# Altium project PCB_Project.PrjPcb
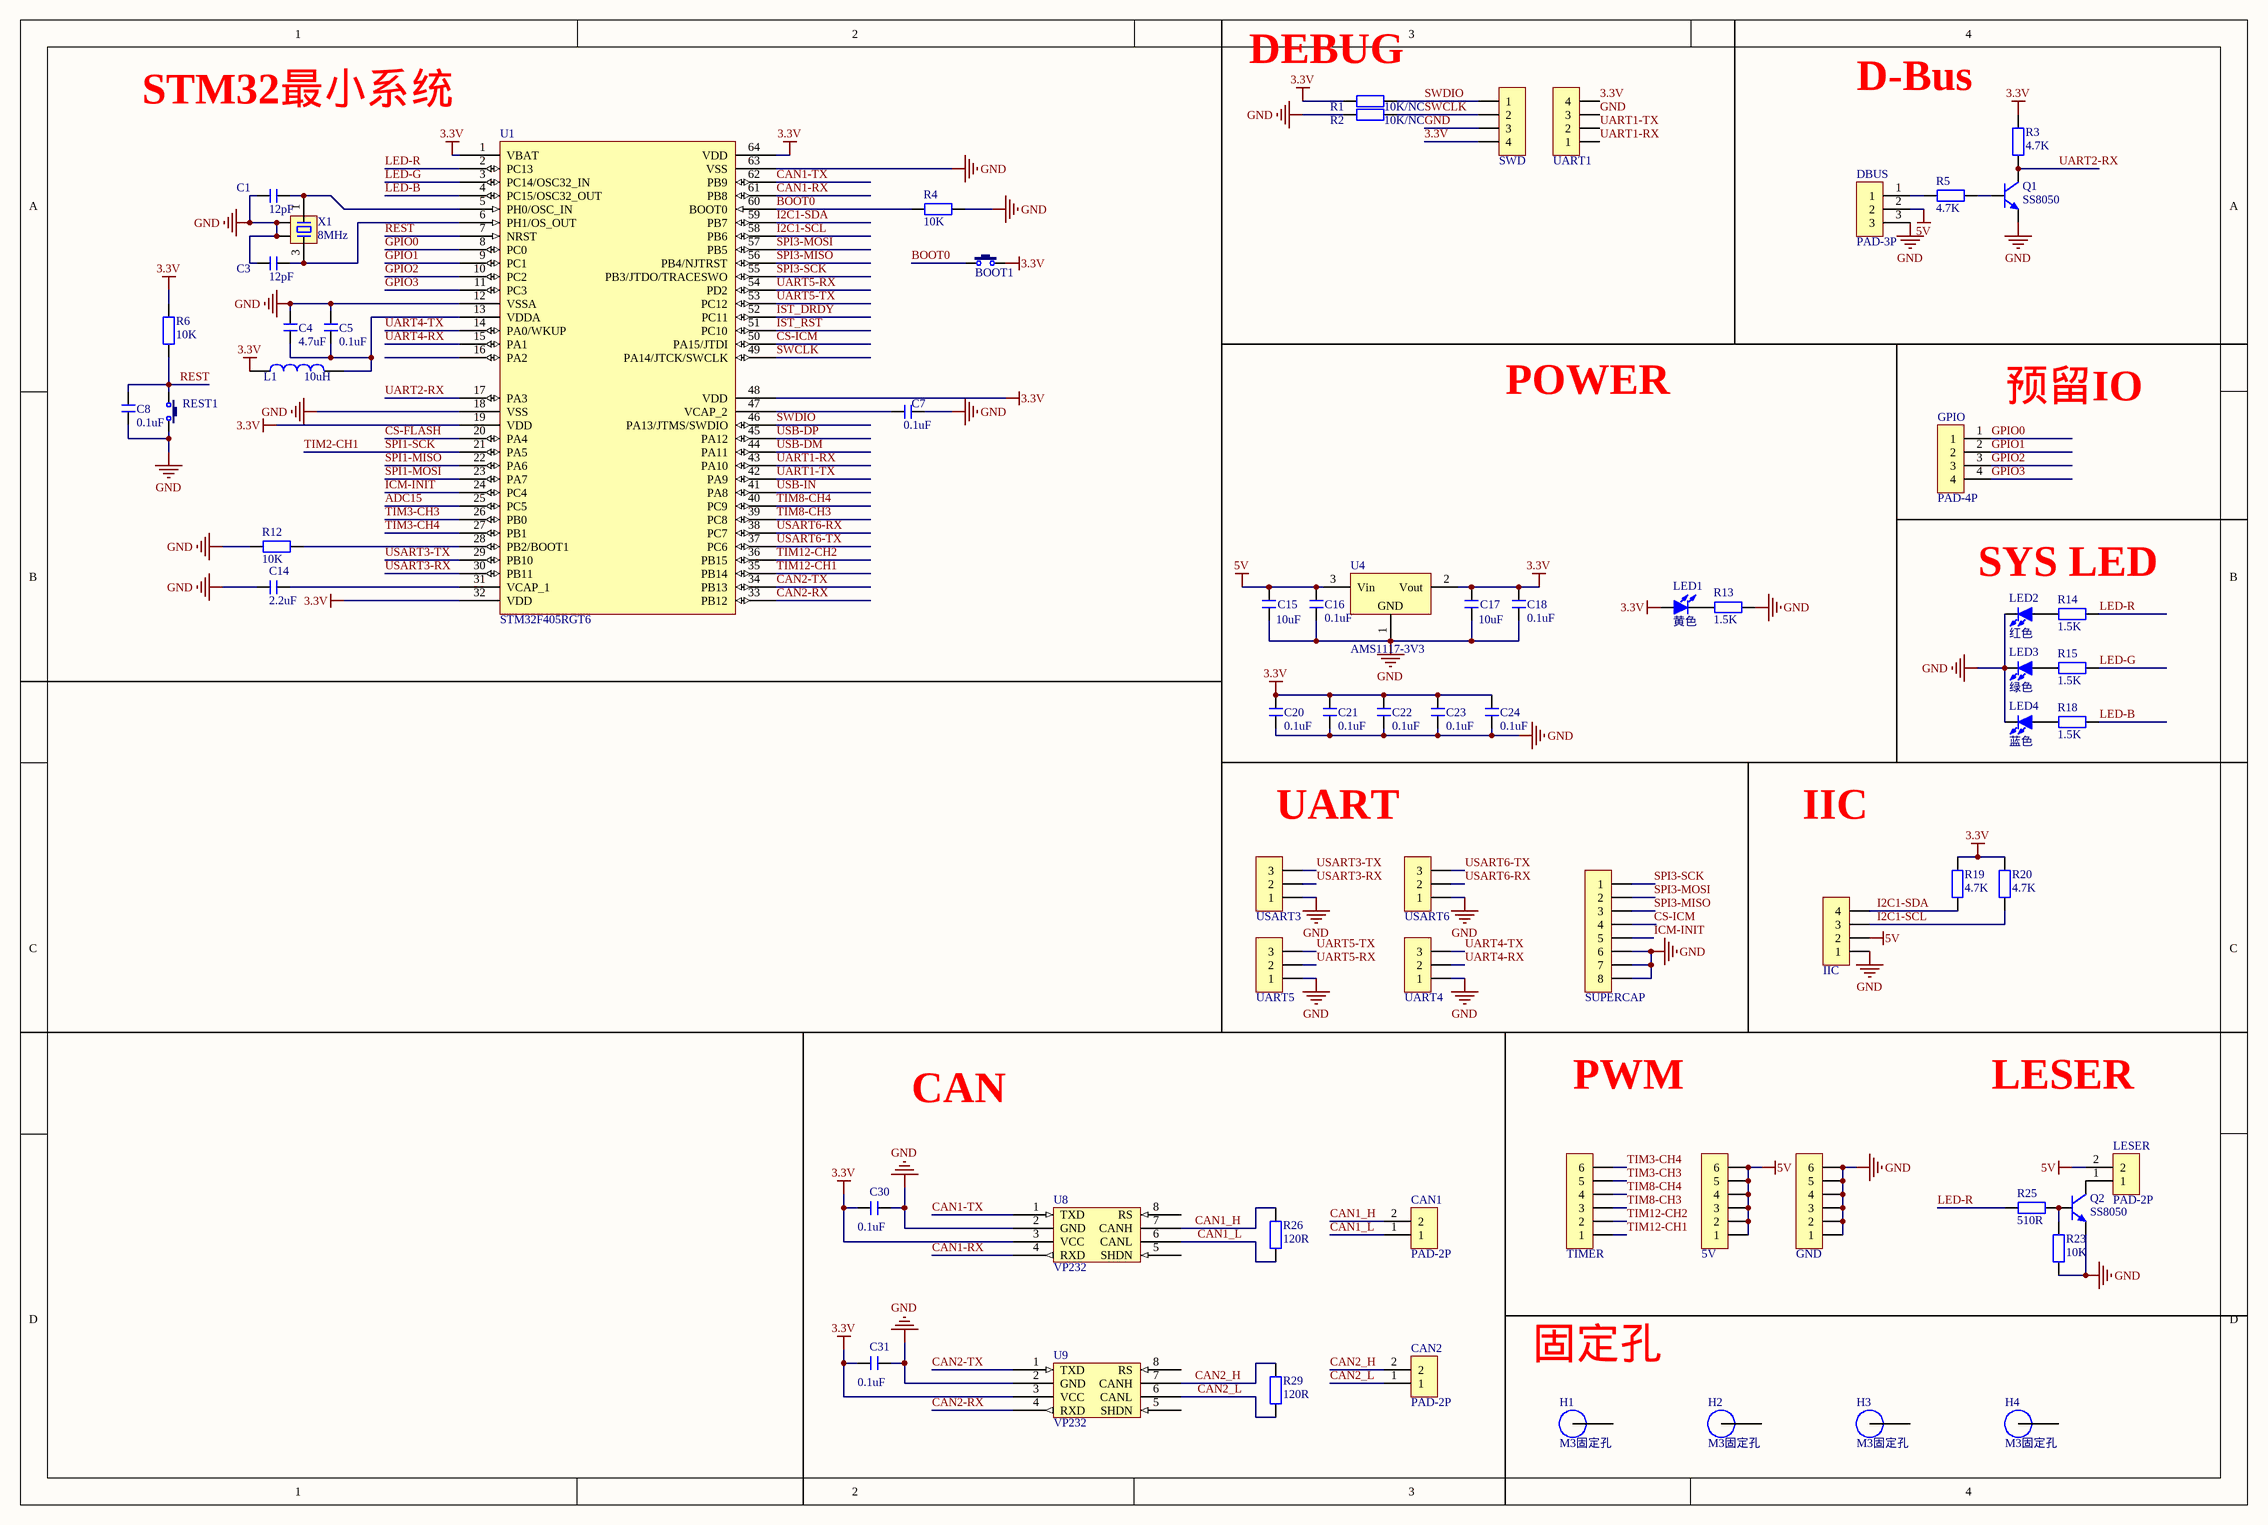
[diagram p0: F4AIR.SchDoc]
1 sheet, 69 parts. Net scope: global (net labels, ports and power ports of the same name join across sheets).
Board file: F4AIR.PcbDoc

## Sheet F4AIR.SchDoc
size 419 x 279 mm

### Parts
5V  HDR-1X6  [HDR2.54-LI-6P]  (value not drawn)
BOOT1  3x6x5  [TSW SMD-3*6*5]  (value not drawn)
C1  12pF  [C 0603_M]
C3  12pF  [C 0603_M]
C4  4.7uF  [C 0603_M]
C5  0.1uF  [C 0603_M]
C7  0.1uF  [C 0603_M]
C8  0.1uF  [C 0603_M]
C14  2.2uF  [C 0603_M]
C15  10uF  [C 0805_M]
C16  0.1uF  [C 0603_M]
C17  10uF  [C 0805_M]
C18  0.1uF  [C 0603_M]
C20  0.1uF  [C 0603_M]
C21  0.1uF  [C 0603_M]
C22  0.1uF  [C 0603_M]
C23  0.1uF  [C 0603_M]
C24  0.1uF  [C 0603_M]
C30  0.1uF  [C 0603_M]
C31  0.1uF  [C 0603_M]
CAN1  PAD-2P  [MX 1.25-WS-2P]
CAN2  PAD-2P  [MX 1.25-WS-2P]
DBUS  PAD-3P  [HDR2.54-WI-3P]
GND  HDR-1X6  [HDR2.54-LI-6P]  (value not drawn)
GPIO  PAD-4P  [PAD-1.25-4P]
H1  M3固定孔  [M3x4_N]
H2  M3固定孔  [M3x4_N]
H3  M3固定孔  [M3x4_N]
H4  M3固定孔  [M3x4_N]
IIC  HDR-1X4  [HDR2.54-LI-4P]  (value not drawn)
L1  10uH  [L 0603]
LED1  黄色  [LED 0603Y]
LED2  红色  [LED 0603R]
LED3  绿色  [LED 0603G]
LED4  蓝色  [LED 0603B]
LESER  PAD-2P  [MX 1.25-WS-2P]
Q1  SS8050  [SOT23-3M]
Q2  SS8050  [SOT23-3M]
R1  10K/NC  [R 0603_M]
R2  10K/NC  [R 0603_M]
R3  4.7K  [R 0603_M]
R4  10K  [R 0603_M]
R5  4.7K  [R 0603_M]
R6  10K  [R 0603_M]
R12  10K  [R 0603_M]
R13  1.5K  [R 0603_M]
R14  1.5K  [R 0603_M]
R15  1.5K  [R 0603_M]
R18  1.5K  [R 0603_M]
R19  4.7K  [R 0603_M]
R20  4.7K  [R 0603_M]
R23  10K  [R 0603_M]
R25  510R  [R 0603_M]
R26  120R  [R 0603_M]
R29  120R  [R 0603_M]
REST1  3x6x5  [TSW SMD-3*6*5]  (value not drawn)
SUPERCAP  HDR-1X8  [MX 1.25-WS-6P]  (value not drawn)
SWD  HDR-1X4  [MX 1.25-WS-4P]  (value not drawn)
TIMER  HDR-1X6  [HDR2.54-LI-6P]  (value not drawn)
U1  STM32F405RGT6  [LQFP64]
U4  AMS1117-3V3  [SOT-89]
U8  VP232  [SOP8_M]
U9  VP232  [SOP8_M]
UART1  HDR-1X4  [MX 1.25-WS-4P]  (value not drawn)
UART4  HDR-1X3  [MX 1.25-WS-3P]  (value not drawn)
UART5  HDR-1X3  [MX 1.25-WS-3P]  (value not drawn)
USART3  HDR-1X3  [MX 1.25-WS-3P]  (value not drawn)
USART6  HDR-1X3  [MX 1.25-WS-3P]  (value not drawn)
X1  8MHz  [OSC 3225-4P]

### Nets
3.3V: BOOT1.2 C17.2 C18.1 C20.1 C21.1 C22.1 C23.1 C24.1 C30.2 C31.2 L1.1 LED1.1(A) R1.1 R3.2 R6.2 R19.1 R20.2 SWD.4 U1.1(VBAT) U1.19(VDD) U1.32(VDD) U1.48(VDD) U1.64(VDD) U4.2(Vout) U8.3(VCC) U9.3(VCC) UART1.4
5V: 5V.1 5V.2 5V.3 5V.4 5V.5 5V.6 C15.2 C16.1 DBUS.2 IIC.2 LESER.2 U4.3(Vin)
GND: C1.1 C3.1 C4.2 C5.2 C7.2 C8.1 C14.1 C15.1 C16.2 C17.1 C18.2 C20.2 C21.2 C22.2 C23.2 C24.2 C30.1 C31.1 DBUS.3 GND.1 GND.2 GND.3 GND.4 GND.5 GND.6 IIC.1 LED2.2(K) LED3.2(K) LED4.2(K) Q1.2(E) Q2.2(E) R2.1 R4.2 R12.1 R13.2 R23.1 REST1.2 SUPERCAP.6 SUPERCAP.7 SUPERCAP.8 SWD.3 U1.12(VSSA) U1.18(VSS) U1.63(VSS) U4.1(GND) U8.2(GND) U9.2(GND) UART1.3 UART4.1 UART5.1 USART3.1 USART6.1 X1.2 X1.4
ADC15: U1.25(PC5)
BOOT0: BOOT1.1 R4.1 U1.60(BOOT0)
CAN1-RX: U1.61(PB8) U8.4(RXD)
CAN1-TX: U1.62(PB9) U8.1(TXD)
CAN1_H: CAN1.2 R26.2 U8.7(CANH)
CAN1_L: CAN1.1 R26.1 U8.6(CANL)
CAN2-RX: U1.33(PB12) U9.4(RXD)
CAN2-TX: U1.34(PB13) U9.1(TXD)
CAN2_H: CAN2.2 R29.2 U9.7(CANH)
CAN2_L: CAN2.1 R29.1 U9.6(CANL)
CS-FLASH: U1.20(PA4)
CS-ICM: SUPERCAP.4 U1.50(PA15/JTDI)
GPIO0: GPIO.1 U1.8(PC0)
GPIO1: GPIO.2 U1.9(PC1)
GPIO2: GPIO.3 U1.10(PC2)
GPIO3: GPIO.4 U1.11(PC3)
I2C1-SCL: IIC.3 R20.1 U1.58(PB6)
I2C1-SDA: IIC.4 R19.2 U1.59(PB7)
ICM-INIT: SUPERCAP.5 U1.24(PC4)
IST_DRDY: U1.52(PC11)
IST_RST: U1.51(PC10)
LED-B: R18.2 U1.4(PC15/OSC32_OUT)
LED-G: R15.2 U1.3(PC14/OSC32_IN)
LED-R: R14.2 R25.1 U1.2(PC13)
REST: C8.2 R6.1 REST1.1 U1.7(NRST)
SPI1-MISO: U1.22(PA6)
SPI1-MOSI: U1.23(PA7)
SPI1-SCK: U1.21(PA5)  [also labelled TIM2-CH1]
SPI3-MISO: SUPERCAP.3 U1.56(PB4/NJTRST)
SPI3-MOSI: SUPERCAP.2 U1.57(PB5)
SPI3-SCK: SUPERCAP.1 U1.55(PB3/JTDO/TRACESWO)
SWCLK: R2.2 SWD.2 U1.49(PA14/JTCK/SWCLK)
SWDIO: R1.2 SWD.1 U1.46(PA13/JTMS/SWDIO)
TIM3-CH3: TIMER.5 U1.26(PB0)
TIM3-CH4: TIMER.6 U1.27(PB1)
TIM8-CH3: TIMER.3 U1.39(PC8)
TIM8-CH4: TIMER.4 U1.40(PC9)
TIM12-CH1: TIMER.1 U1.35(PB14)
TIM12-CH2: TIMER.2 U1.36(PB15)
UART1-RX: U1.43(PA10) UART1.1
UART1-TX: U1.42(PA9) UART1.2
UART2-RX: Q1.3(C) R3.1 U1.17(PA3)
UART4-RX: U1.15(PA1) UART4.2
UART4-TX: U1.14(PA0/WKUP) UART4.3
UART5-RX: U1.54(PD2) UART5.2
UART5-TX: U1.53(PC12) UART5.3
USART3-RX: U1.30(PB11) USART3.2
USART3-TX: U1.29(PB10) USART3.3
USART6-RX: U1.38(PC7) USART6.2
USART6-TX: U1.37(PC6) USART6.3
USB-DM: U1.44(PA11)
USB-DP: U1.45(PA12)
USB-IN: U1.41(PA8)
NetC1_2: C1.2 U1.5(PH0/OSC_IN) X1.1
NetC3_2: C3.2 U1.6(PH1/OS_OUT) X1.3
NetC4_1: C4.1 C5.1 L1.2 U1.13(VDDA)
NetC7_1: C7.1 U1.47(VCAP_2)
NetC14_2: C14.2 U1.31(VCAP_1)
NetDBUS_1: DBUS.1 R5.1
NetLED1_2: LED1.2(K) R13.1
NetLED2_1: LED2.1(A) R14.1
NetLED3_1: LED3.1(A) R15.1
NetLED4_1: LED4.1(A) R18.1
NetLESER_1: LESER.1 Q2.3(C)
NetQ1_1: Q1.1(B) R5.2
NetQ2_1: Q2.1(B) R23.2 R25.2
NetR12_2: R12.2 U1.28(PB2/BOOT1)

Not connected (* = marked no-connect by the designer): H1 1; H2 1; H3 1; H4 1; U1 16(PA2); U8 5(SHDN) 8(RS); U9 5(SHDN) 8(RS)

### Notes on the sheet
- STM32最小系统
- DEBUG
- D-Bus
- POWER
- (near GPIO) 预留IO
- SYS LED
- (near USART3) UART
- IIC
- CAN
- PWM
- LESER
- 固定孔
- Title
- Size:
- Date:
- A3
- Number:
- Time:
- Revision:
- Sheet
- of
- File:

### Library data of the parts
5V GND TIMER = Header 6: 6P接插件; 版权归属: 源创客; BOM名称: 6P接插件; 学习资源: www.ooocke.com
BOOT1 REST1 = TSW 3x6: 3x6轻触开关; 版权归属: 源创客; BOM名称: 3x6轻触开关; 学习资源: www.ooocke.com
C1 C3-C5 C7 C8 C14-C18 C20-C24 C30 C31 = C: 无极性贴片电容; 版权归属: 源创客; BOM名称: 无极性贴片电容; 学习资源: www.ooocke.com
H1-H4 = M3: 铜柱孔; 版权归属: 源创客; BOM名称: 铜柱孔; 学习资源: www.ooocke.com
IIC UART1 = HDR 2.54 -4P_1: HDR 2.54 -4P
L1 = L: 小功率贴片电感; 版权归属: 源创客; BOM名称: 小功率贴片电感; 学习资源: www.ooocke.com
LED1-LED4 = LED-SMD: 贴片LED; 版权归属: 源创客; BOM名称: 贴片LED; 学习资源: www.ooocke.com
Q1 Q2 = 8050-SMD: 高频放大-NPN型
R1-R6 R12-R15 R18-R20 R23 R25 R26 R29 = R: 贴片电阻; 版权归属: 源创客; BOM名称: 贴片电阻; 学习资源: www.ooocke.com
SUPERCAP = HDR 2.54 -8P
SWD = MX 1.25 -4P
U4 = AMS1117: 三端稳压芯片; BOM名称: 稳压芯片; 版权归属: 源创客; 学习资源: www.ooocke.com
U8 U9 = MAX3051EKA+T: CAN芯片
UART4 UART5 USART3 USART6 = HDR 2.54 -3P
X1 = XTAL-4P: 4脚无源晶振; 版权归属: 源创客; BOM名称: 4脚无源晶振; 学习资源: www.ooocke.com